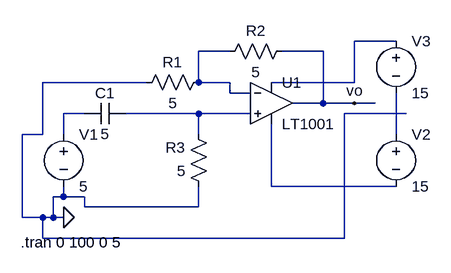
[diagram p0: schematic sinha.asc]
sinha.asc, the LTspice schematic file:
Version 4
SHEET 1 880 680
WIRE 480 0 416 0
WIRE 224 16 176 16
WIRE 368 16 304 16
WIRE 96 64 -64 64
WIRE 176 64 176 16
WIRE 224 64 176 64
WIRE 416 64 416 0
WIRE 416 64 288 64
WIRE 224 80 224 64
WIRE 256 80 224 80
WIRE 368 96 368 16
WIRE 368 96 320 96
WIRE 416 96 368 96
WIRE 448 96 416 96
WIRE 0 112 -32 112
WIRE 176 112 64 112
WIRE 256 112 176 112
WIRE 496 112 400 112
WIRE -64 144 -64 64
WIRE -64 144 -96 144
WIRE -32 144 -32 112
WIRE 176 144 176 112
WIRE 480 144 480 80
WIRE 288 224 288 128
WIRE 480 224 288 224
WIRE -32 240 -32 224
WIRE -32 240 -48 240
WIRE 0 240 -32 240
WIRE 0 256 0 240
WIRE 176 256 176 224
WIRE 176 256 0 256
WIRE -96 272 -96 144
WIRE -64 272 -96 272
WIRE -48 272 -48 240
WIRE -48 272 -64 272
WIRE -32 272 -48 272
WIRE -64 304 -64 272
WIRE 400 304 400 112
WIRE 400 304 -64 304
FLAG -32 272 0
FLAG 416 96 vo
SYMBOL res 192 48 R90
WINDOW 0 0 56 VBottom 2
WINDOW 3 32 56 VTop 2
SYMATTR InstName R1
SYMATTR Value 5
SYMBOL res 320 0 R90
WINDOW 0 0 56 VBottom 2
WINDOW 3 32 56 VTop 2
SYMATTR InstName R2
SYMATTR Value 5
SYMBOL res 192 240 R180
WINDOW 0 36 76 Left 2
WINDOW 3 36 40 Left 2
SYMATTR InstName R3
SYMATTR Value 5
SYMBOL Opamps\\LT1001 288 32 R0
SYMATTR InstName U1
SYMBOL cap 64 96 R90
WINDOW 0 0 32 VBottom 2
WINDOW 3 32 32 VTop 2
SYMATTR InstName C1
SYMATTR Value 5
SYMBOL voltage -32 128 R0
WINDOW 123 0 0 Left 2
WINDOW 39 0 0 Left 2
SYMATTR InstName V1
SYMATTR Value 5
SYMBOL voltage 480 128 R0
WINDOW 123 0 0 Left 2
WINDOW 39 0 0 Left 2
SYMATTR InstName V2
SYMATTR Value 15
SYMBOL voltage 480 -16 R0
WINDOW 123 0 0 Left 2
WINDOW 39 0 0 Left 2
SYMATTR InstName V3
SYMATTR Value 15
TEXT -98 310 Left 2 !.tran 0 100 0 5

The netlist it stands for:
* sinha.asc
R1 N002 0 5
R2 vo N002 5
R3 0 N004 5
XU1 N004 N002 N001 N006 vo LT1001  ; pins In+ In- V+ V- OUT
C1 N004 N003 5
V1 N003 0 5
V2 N005 N006 15
V3 N001 N005 15
.tran 0 100 0 5
.lib LTC.lib
.backanno
.end